# EAGLE design 20160303_hello_world (EAGLE 7.3.0)
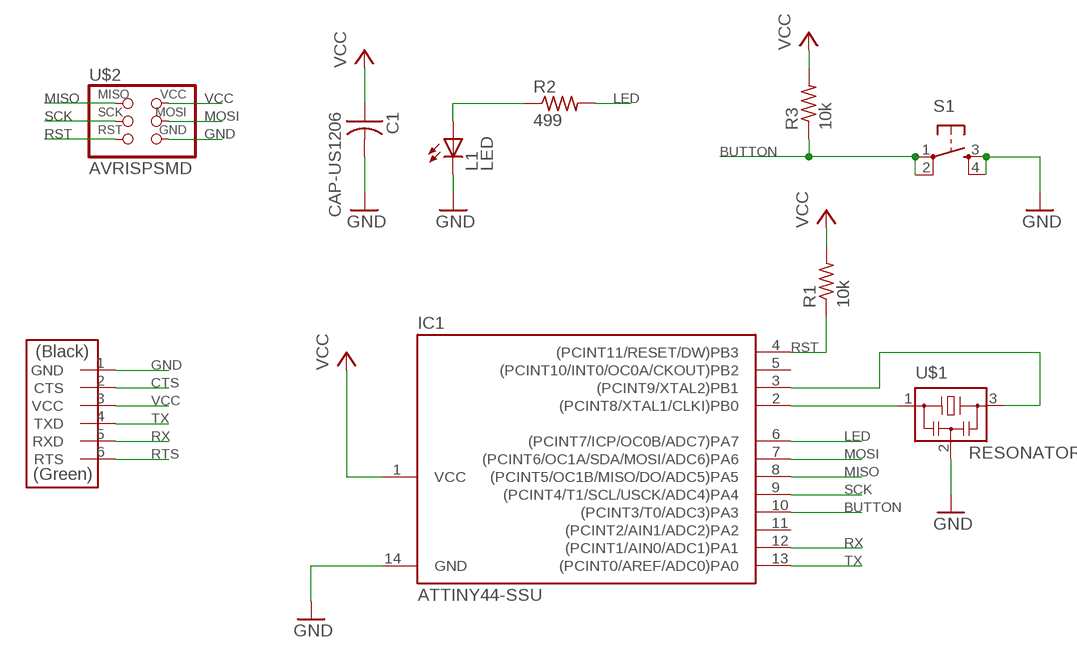
[diagram p0: schematic, sheet 1]

## Parts
C1  CAP-US1206  [C1206]
IC1  ATTINY44-SSU  [SOIC14]
JP1  FTDI-SMD-HEADER  [1X06SMD]
L1  LED  [LED1206]
R1  10k  RES-US1206  [R1206]
R2  499  RES-US1206  [R1206]
R3  10k  RES-US1206  [R1206]
S1  6MM_SWITCH6MM_SWITCH  [6MM_SWITCH]
U$1  RESONATOR  [EFOBM]
U$2  AVRISPSMD  [2X03SMD]

## Nets
BUTTON: IC1.10((PCINT3/T0/ADC3)PA3) R3.1 S1.1(P) S1.2(P1)
CTS: JP1.2(CTS)
GND: C1.2 IC1.14(GND) JP1.1(GND) L1.2(C) S1.3(S) S1.4(S1) U$1.2 U$2.6(GND)
LED: IC1.6((PCINT7/ICP/OC0B/ADC7)PA7) R2.2
MISO: IC1.8((PCINT5/OC1B/MISO/DO/ADC5)PA5) U$2.1(MISO)
MOSI: IC1.7((PCINT6/OC1A/SDA/MOSI/ADC6)PA6) U$2.4(MOSI)
N$1: L1.1(A) R2.1
N$4: IC1.2((PCINT8/XTAL1/CLKI)PB0) U$1.1
N$16: IC1.3((PCINT9/XTAL2)PB1) U$1.3
RST: IC1.4((PCINT11/RESET/DW)PB3) R1.1 U$2.5(RST)
RTS: JP1.6(RTS)
RX: IC1.12((PCINT1/AIN0/ADC1)PA1) JP1.5(RXD)
SCK: IC1.9((PCINT4/T1/SCL/USCK/ADC4)PA4) U$2.3(SCK)
TX: IC1.13((PCINT0/AREF/ADC0)PA0) JP1.4(TXD)
VCC: C1.1 IC1.1(VCC) JP1.3(VCC) R1.2 R3.2 U$2.2(VCC)
Unconnected: IC1.5((PCINT10/INT0/OC0A/CKOUT)PB2) IC1.11((PCINT2/AIN1/ADC2)PA2)

## Library data of the parts
C1 = 01_fab:CAP-US
IC1 = 01_fab:ATTINY44
JP1 = 01_fab:FTDI-SMD-HEADER
L1 = 01_fab:LED: LED
R1-R3 = 01_fab:RES-US: Resistor (US Symbol) Variants with postfix FAB are widened to allow the routing of internal traces
S1 = 01_fab:6MM_SWITCH: OMRON SWITCH
U$1 = 01_fab:RESONATOR
U$2 = 01_fab:AVRISP

## Board
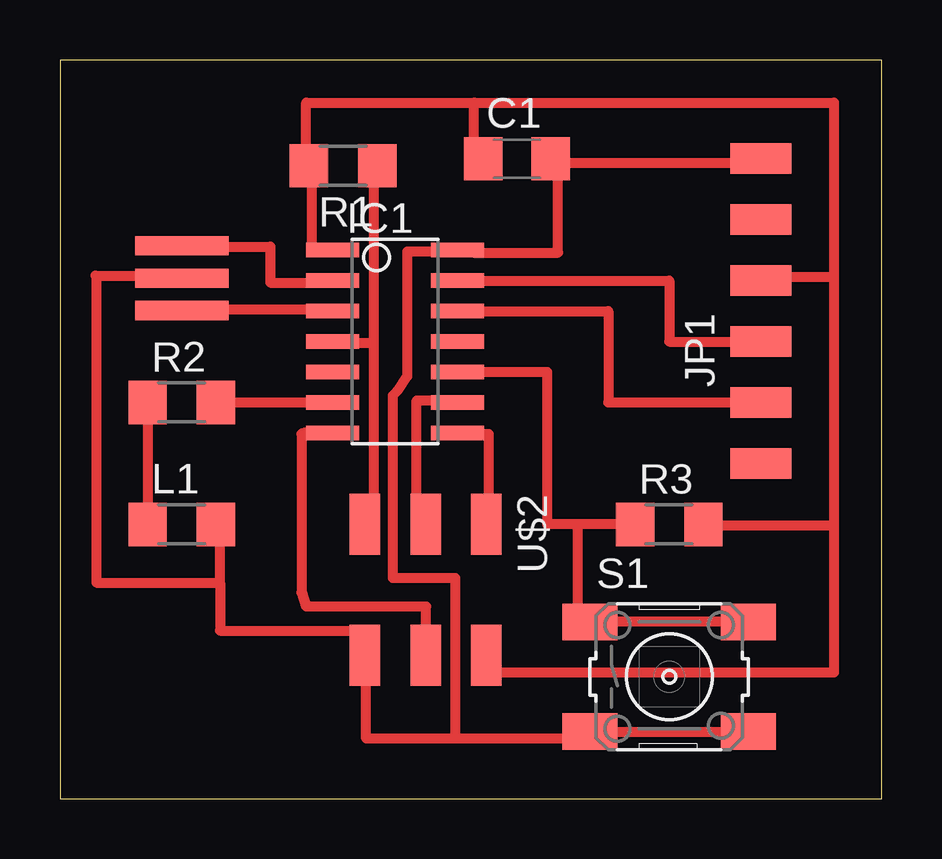
[diagram p1: board, top side]

Size 34.25 x 30.78 mm. Coordinates in mm from the lower left corner, seen from the top.
Outline: 0,0 34.25,0 34.25,30.78 0,30.78 0,0
Copper layers (1*16): Top 0.035mm / dielectric 1.5mm / Bottom 0.035mm
Design rules "default": minimum track width 10mil, minimum drill 24mil, track to track 8mil, track to pad 8mil, pad to pad 8mil, via to via 8mil, smd to smd 8mil, copper to edge 40mil, drill to drill 8mil, minimum pad ring 10mil, minimum via ring 8mil, stop-mask expansion 4mil, vias tented up to drill 0mil, thermal gap 10mil

### Footprints (pad centres in the part's own frame; a part is rotated, then mirrored left to right if it is on the bottom)
C1206 = smd 1.6 x 1.8: 1 -1.4,0; 2 1.4,0
SOIC14 = smd 0.61 x 2.21: 1 -3.81,-2.603; 2 -2.54,-2.603; 3 -1.27,-2.603; 4 0,-2.603; 5 1.27,-2.603; 6 2.54,-2.603; 7 3.81,-2.603; 8 3.81,2.603; 9 2.54,2.603; 10 1.27,2.603; 11 0,2.603; 12 -1.27,2.603; 13 -2.54,2.603; 14 -3.81,2.603
1X06SMD = smd 2.54 x 1.27: 1 0,6.35; 2 0,3.81; 3 0,1.27; 4 0,-1.27; 5 0,-3.81; 6 0,-6.35
LED1206 = smd 1.6 x 1.803: 1 -1.422,0; 2 1.422,0
R1206 = smd 1.6 x 1.803: 1 -1.422,0; 2 1.422,0
6MM_SWITCH = smd 2.286 x 1.524: 1 -3.302,2.286; 2 3.302,2.286; 3 -3.302,-2.286; 4 3.302,-2.286
EFOBM = smd 0.8 x 3.9: 1 -1.35,0; 2 0,0; 3 1.35,0
2X03SMD = smd 2.54 x 1.27: 1 -2.54,2.54; 2 2.92,2.54; 3 -2.54,0; 4 2.92,0; 5 -2.54,-2.54; 6 2.92,-2.54

### Placement (x,y rotation side)
C1  19.05,26.67 0 top
IC1  13.97,19.05 270 top
JP1  29.21,20.32 0 top
L1  5.08,11.43 0 top
R1  11.8,26.37 180 top
R2  5.08,16.51 0 top
R3  25.4,11.43 0 top
S1  25.4,5.08 0 top
U$1  5.08,21.69 270 top
U$2  15.24,8.89 270 top

### Tracks (layer width: path | path; a pad name or v marks a point on that pad's centre or on a via)
BUTTON
  Top 0.406: R3.1 21.59,11.43 | 21.59,11.43 20.32,11.43 20.32,17.78 IC1.10 | 21.59,11.43 21.59,7.62 S1.1 22.07,7.4 28.07,7.4 S1.2
GND
  Top 0.406: 16.47,2.5 21.27,2.5 21.27,2.75 S1.3 22.07,2.8 29.27,2.8 S1.4 28.67,2.8 | 16.47,2.5 12.77,2.5 12.77,5 U$2.6 12.67,7 6.67,7 6.67,9 | 20.77,26.5 20.77,22.75 17.27,22.75 IC1.14 15.77,22.75 15.67,22.8 14.47,22.8 14.47,17.6 14.07,17 13.87,16.8 13.87,9.2 16.47,9.2 16.47,2.5 | 20.77,26.5 28.02,26.5 JP1.1 | 20.77,26.5 C1.2 | U$1.2 4.27,21.8 1.47,21.8 1.52,21.75 1.52,9 6.67,9 | 6.67,9 6.67,10.8 L1.2
LED
  Top 0.406: R2.2 IC1.6
MISO
  Top 0.406: IC1.8 17.87,15.2 17.87,12.2 U$2.1
MOSI
  Top 0.406: IC1.7 10.16,15.24 10.07,15.2 10.07,8.6 10.27,8 15.27,8 15.24,6.35 U$2.4
N$1
  Top 0.406: R2.1 L1.1
N$4
  Top 0.406: IC1.2 10.77,21.5 8.77,21.5 8.77,23 5.67,23 U$1.1
N$16
  Top 0.406: U$1.3 5.07,20.4 10.67,20.4 IC1.3
RST
  Top 0.406: R1.1 13.27,25.8 13.07,26 13.07,19 | 13.07,19 13.07,12.4 U$2.5 | IC1.4 11.47,19 13.07,19
RX
  Top 0.406: IC1.12 22.86,20.32 22.86,16.51 JP1.5
SCK
  Top 0.406: U$2.3 14.87,12.4 14.87,16.6 16.07,16.6 IC1.9
TX
  Top 0.406: IC1.13 25.4,21.59 25.4,19.05 JP1.4
VCC
  Top 0.406: IC1.1 10.52,22.75 10.52,25.75 R1.2 10.27,27 10.27,29 17.27,29 | 17.27,29 32.27,29 32.27,21.75 | 32.27,21.75 32.27,11.4 | 32.27,11.4 32.27,5.25 18.27,5.25 U$2.2 | JP1.3 30.02,21.75 32.27,21.75 | C1.1 17.27,27 17.27,29 | R3.2 26.87,11.4 32.27,11.4